# Altium schematic sheet Dev_BRD_STM32F030F4P6TR.SchDoc
size A4 portrait
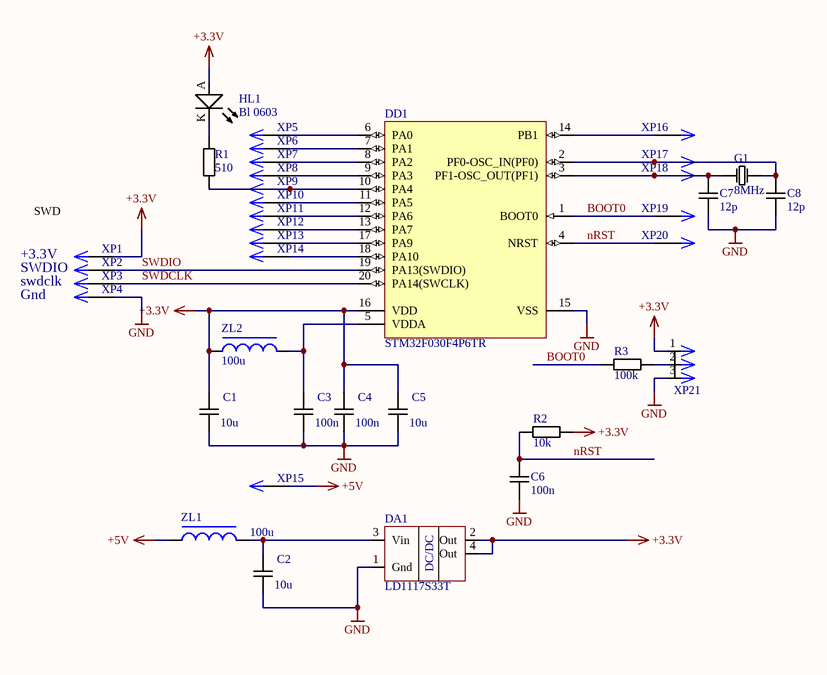
[diagram p0: Dev_BRD_STM32F030F4P6TR.SchDoc]

## Parts
C1  10u  [CAPC1608(0603)N]
C2  10u  [CAPC1608(0603)N]
C3  100n  [CAPC1608(0603)N]
C4  100n  [CAPC1608(0603)N]
C5  10u  [CAPC1608(0603)N]
C6  100n  [CAPC1608(0603)N]
C7  12p  [CAPC1608(0603)N]
C8  12p  [CAPC1608(0603)N]
DA1  LD1117S33T  [SOT223_M]
DD1  STM32F030F4P6TR  [STM-TSSOP20_M]
G1  8MHz  [HC-49/S]
HL1  Bl 0603  [LED-0603-BLUE]
R1  510  [RESC1608(0603)N]
R2  10k  [RESC1608(0603)N]
R3  100k  [RESC1608(0603)N]
XP1  PLS-1  [PLS-1-3D]  (value not drawn)
XP2  PLS-1  [PLS-1-3D]  (value not drawn)
XP3  PLS-1  [PLS-1-3D]  (value not drawn)
XP4  PLS-1  [PLS-1-3D]  (value not drawn)
XP5  PLS-1  [PLS-1-3D]  (value not drawn)
XP6  PLS-1  [PLS-1-3D]  (value not drawn)
XP7  PLS-1  [PLS-1-3D]  (value not drawn)
XP8  PLS-1  [PLS-1-3D]  (value not drawn)
XP9  PLS-1  [PLS-1-3D]  (value not drawn)
XP10  PLS-1  [PLS-1-3D]  (value not drawn)
XP11  PLS-1  [PLS-1-3D]  (value not drawn)
XP12  PLS-1  [PLS-1-3D]  (value not drawn)
XP13  PLS-1  [PLS-1-3D]  (value not drawn)
XP14  PLS-1  [PLS-1-3D]  (value not drawn)
XP15  PLS-1  [PLS-1-3D]  (value not drawn)
XP16  PLS-1  [PLS-1-3D]  (value not drawn)
XP17  PLS-1  [PLS-1-3D]  (value not drawn)
XP18  PLS-1  [PLS-1-3D]  (value not drawn)
XP19  PLS-1  [PLS-1-3D]  (value not drawn)
XP20  PLS-1  [PLS-1-3D]  (value not drawn)
XP21  PLS-3  [PLS-3-3D]  (value not drawn)
ZL1  100u  [INDC1608(0603)N]
ZL2  100u  [INDC1608(0603)N]

## Nets
+3.3V: C1.2 C4.2 C5.2 DA1.2(Out) DA1.4(Out) DD1.16(VDD) HL1.A R2.2 XP1.1 XP21.1 ZL2.1
+5V: XP15.1 ZL1.1
GND: C1.1 C2.1 C3.1 C4.1 C5.1 C6.1 C7.1 C8.1 DA1.1(Gnd) DD1.15(VSS) XP4.1 XP21.3
BOOT0: DD1.1(BOOT0) R3.1 XP19.1
nRST: C6.2 DD1.4(NRST) R2.1 XP20.1
SWDCLK: DD1.20(PA14(SWCLK)) XP3.1
SWDIO: DD1.19(PA13(SWDIO)) XP2.1
NetC2_2: C2.2 DA1.3(Vin) ZL1.2
NetC3_2: C3.2 DD1.5(VDDA) ZL2.2
NetC7_2: C7.2 DD1.3(PF1-OSC_OUT(PF1)) G1.1 XP18.1
NetC8_2: C8.2 DD1.2(PF0-OSC_IN(PF0)) G1.2 XP17.1
NetDD1_6: DD1.6(PA0) XP5.1
NetDD1_7: DD1.7(PA1) XP6.1
NetDD1_8: DD1.8(PA2) XP7.1
NetDD1_9: DD1.9(PA3) XP8.1
NetDD1_10: DD1.10(PA4) R1.2 XP9.1
NetDD1_11: DD1.11(PA5) XP10.1
NetDD1_12: DD1.12(PA6) XP11.1
NetDD1_13: DD1.13(PA7) XP12.1
NetDD1_14: DD1.14(PB1) XP16.1
NetDD1_17: DD1.17(PA9) XP13.1
NetDD1_18: DD1.18(PA10) XP14.1
NetHL1_K: HL1.K R1.1
NetR3_2: R3.2 XP21.2

## Notes on the sheet
- +3.3V
- SWDIO
- swdclk
- SWD
- Gnd
- (in symbol LD1117S33T) DC/DC

## Library data of the parts
C1-C8 = CAPC1608(0603): ?; Part Number: CAPC1608(0603); HelpURL: ?; Digi-Key Part Number: ?; Price$: ?; Note: ?; Manufacturer Part Number: ?; Package: ?
DA1 = LD1117S33T: LDO Voltage Regulators 3.3V 0.8A Positive; Part Number: LD1117S33T; HelpURL: http://www.mouser.com/ds/2/389/CD00000544-310772.pdf; Price$: ?; Digi-Key Part Number: ?; Note: ?; Manufacturer Part Number: ?; Package: ?
DD1 = STM32F030F4P6TR: ARM Microcontrollers - MCU Entry-level ARM Cortex-M0 Value MCU; FLASH Size (Prog) (kB): 16; I/Os (High Current): 15; Internal RAM Size (kB): 4; Operating Frequency(F) (Processor speed) (MHz): 48; Packing: Tube; Supply Voltage(Vcc) min (V): 2.4; DatasheetVersion: Rev. 1; PackageVersion: Rev. 1, 11/2012; PackageReference: TSSOP20; PackageDescription: 20-Pin Thin Shrink Small Outline Package, 6.5 x 4.4 mm Body, 0.65 mm Pitch; Supplier 1: Digi-Key; Supplier Part Number 1: 497-14044-5-ND; Supplier 2: Newark; Supplier Part Number 2: 06X3648; Supplier 3: Mouser; Supplier Part Number 3: 511-STM32F030F4P6; Core: ARM Cortex-M0; Mounting Technology: Surface Mount; PartNumber: STM32F030F4P6; ComponentLink1Description: Manufacturer URL; ComponentLink1URL: http://www.st.com/web/en/home.html; ComponentLink2Description: Datasheet; ComponentLink2URL: http://www.st.com/st-web-ui/static/active/en/resource/technical/document/datasheet/DM00088500.pdf; ComponentLink3Description: Package Specification; ComponentLink3URL: http://www.st.com/st-web-ui/static/active/en/resource/technical/document/datasheet/DM00065136.pdf; Part Number: STM32F030F4P6TR; HelpURL: https://www.mouser.com/ProductDetail/STMicroelectronics/STM32F030F4P6TR?qs=%2Fha2pyFadujR%2FWSfahMbfmbDlEliJR9JQ7e4pIkAHR743YF4U76%252Bsg%3D%3D; Price$: 0.534; Manufacturer Part Number: STM32F030F4P6TR; Package: TSSOP-20; Mouser Part Number: 511-STM32F030F4P6TR
G1 = Crystal HC-49/S: Part Number: Crystal HC-49/S
HL1 = 150060BS55040: LED BLUE DIFFUSED 0603 SMD; Part Number: 150060BS55040; HelpURL: https://www.digikey.com/products/en?keywords=732-12013-1-ND; Digi-Key Part Number: 732-12013-1-ND; Manufacturer Part Number: 150060BS55040; Package: 0603
R1-R3 = RESC1608(0603): Note: ???; Part Number: RESC1608(0603); HelpURL: ???; Digi-Key Part Number: ???; Price$: ???; Manufacturer Part Number: ???; Package: ???
XP1-XP20 = PLS-1: CONN HEADER VERT 1POS; Manufacturer Part Number: PRPC001SAAN-RC; Note: ???; Part Number: PLS-1; HelpURL: https://www.digikey.com/product-detail/en/sullins-connector-solutions/PRPC001SAAN-RC/S1011EC-01-ND/2775253; Digi-Key Part Number: S1011EC-01-ND; Price$: 0.05
XP21 = PR20203VBNN: CONN HEADER VERT 3POS 2.54MM; Part Number: PR20203VBNN; HelpURL: https://www.digikey.com/product-detail/en/metz-connect-usa-inc/PR20203VBNN/1849-1003-ND/7794768; Digi-Key Part Number: 1849-1003-ND; Manufacturer Part Number: PR20203VBNN; Package: Header 3POS 2.54mm
ZL1 ZL2 = Ferite1608(0603): ferite bead; Note: ???; Part Number: Ferite1608(0603); Digi-Key Part Number: ???; Price$: ???; Manufacturer Part Number: ???; Package: ???